# EasyEDA schematic SCH_Приёмник-MIDI.json
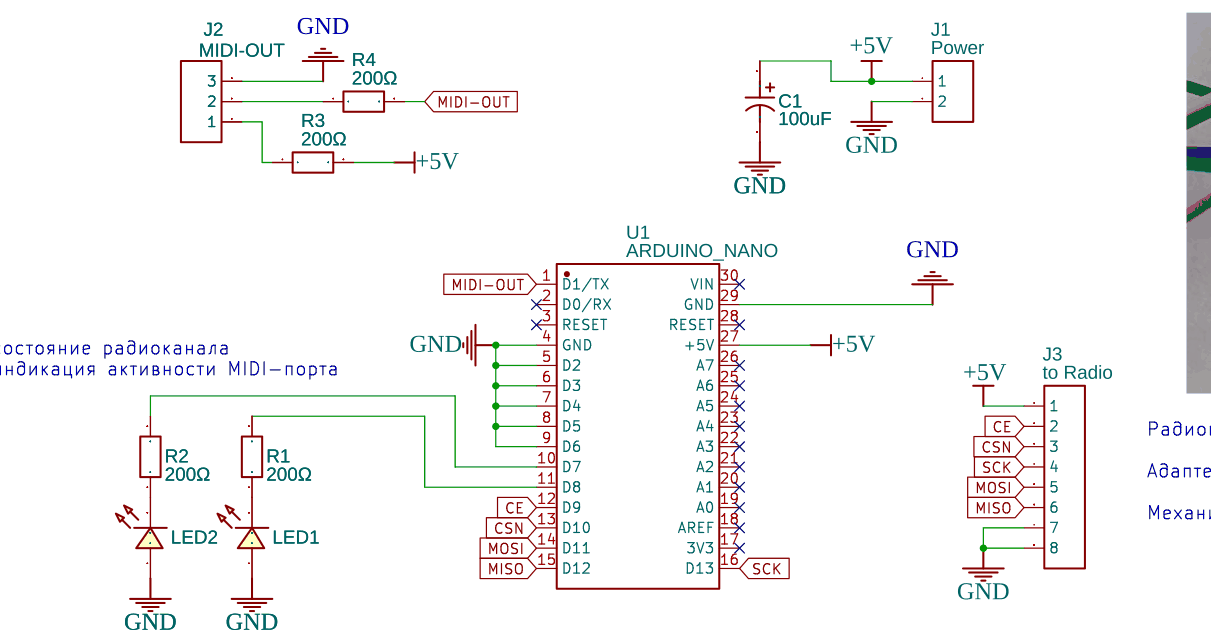
[diagram p0: schematic sheet]

## Parts
C1  100uF  [CAP-TH_BD5.0-P2.00-D0.5-FD-1]
J1  Power  [HDR-M-2.54_1X2]
J2  MIDI-OUT  [HDR-M-2.54_1X3]
J3  to Radio  [HDR-M-2.54_1X8]
LED1  LED-TH-3mm_R  [LED-TH_BD3.0_RED]
LED2  LED-TH-3mm_R  [LED-TH_BD3.0_RED]
R1  200Ω  [RES-TH_BD2.3-L3.7-P7.70-D0.4]
R2  200Ω  [RES-TH_BD2.3-L3.7-P7.70-D0.4]
R3  200Ω  [RES-TH_BD2.3-L3.7-P7.70-D0.4]
R4  200Ω  [RES-TH_BD2.3-L3.7-P7.70-D0.4]
U1  ARDUINO_NANO  [COMM-TH_ARDUINO_NANO]

## Library data of the parts
C1 = 01EC1385: Supplier: LCSC; Supplier Part: C2831771; Manufacturer: KNSCHA(科尼盛); JLCPCB Part Class: Extended Part; Contributor: lcsc
J1 = HDR-M-2.54_1x2: Supplier Part: C124375; Supplier: LCSC; Contributor: LCEDA_Lib
J2 = HDR-M-2.54_1x3: Supplier Part: C180248; Supplier: LCSC; Contributor: LCEDA_Lib
J3 = HDR-M-2.54_1x8: Supplier Part: C190820; Supplier: LCSC; Contributor: LCEDA_Lib
LED1 LED2 = LED-TH-3mm_R: Manufacturer: EVERLIGHT(台湾亿光); Manufacturer Part: 204-10SDRD/S530-A3-L; Supplier Part: C84774; Supplier: LCSC; Contributor: LCEDA_Lib
R1-R4 = CR1/8W-200Ω±5%-OT52: Contributor: lcsc; Supplier: LCSC; Supplier Part: C2896969; Manufacturer: VO(翔胜)
U1 = ARDUINO_NANO: Contributor: lcsc; Supplier: LCSC; Supplier Part: C9900017879; Manufacturer: null; JLCPCB Part Class: Extended Part

## Nets
+5V: C1.1 J1.1 J3.1 R3.2 U1.27(+5V)
GND: C1.2 J1.2 J2.3 J3.7 J3.8 LED1.1 LED2.1 U1.4(GND) U1.5(D2) U1.6(D3) U1.7(D4) U1.8(D5) U1.9(D6) U1.29(GND)
CE: J3.2 U1.12(D9)
CSN: J3.3 U1.13(D10)
MIDI-OUT: R4.2 U1.1(D1/TX)
MISO: J3.6 U1.15(D12)
MOSI: J3.5 U1.14(D11)
SCK: J3.4 U1.16(D13)
Net-(J2-1): J2.1 R3.1
Net-(J2-2): J2.2 R4.1
Net-(LED1-2): LED1.2 R1.1
Net-(LED2-2): LED2.2 R2.1
Net-(R1-2): R1.2 U1.11(D8)
Net-(R2-2): R2.2 U1.10(D7)

Not connected (* = marked no-connect by the designer): U1 2(D0/RX)* 3(RESET)* 17(3V3)* 18(AREF)* 19(A0)* 20(A1)* 21(A2)* 22(A3)* 23(A4)* 24(A5)* 25(A6)* 26(A7)* 28(RESET)* 30(VIN)*

## Notes on the sheet
- LED1 - состояние радиоканала
  LED2 - индикация активности MIDI-порта
- Радиомодуль подключается через адаптер.
  Адаптер проводами соединен с основной платой (обязательно паять!)
  Механически адаптер приклеен к основной плате на 2-сторонний скотч или термоклеем.
